# Altium project Flight_Controller.PrjPcb
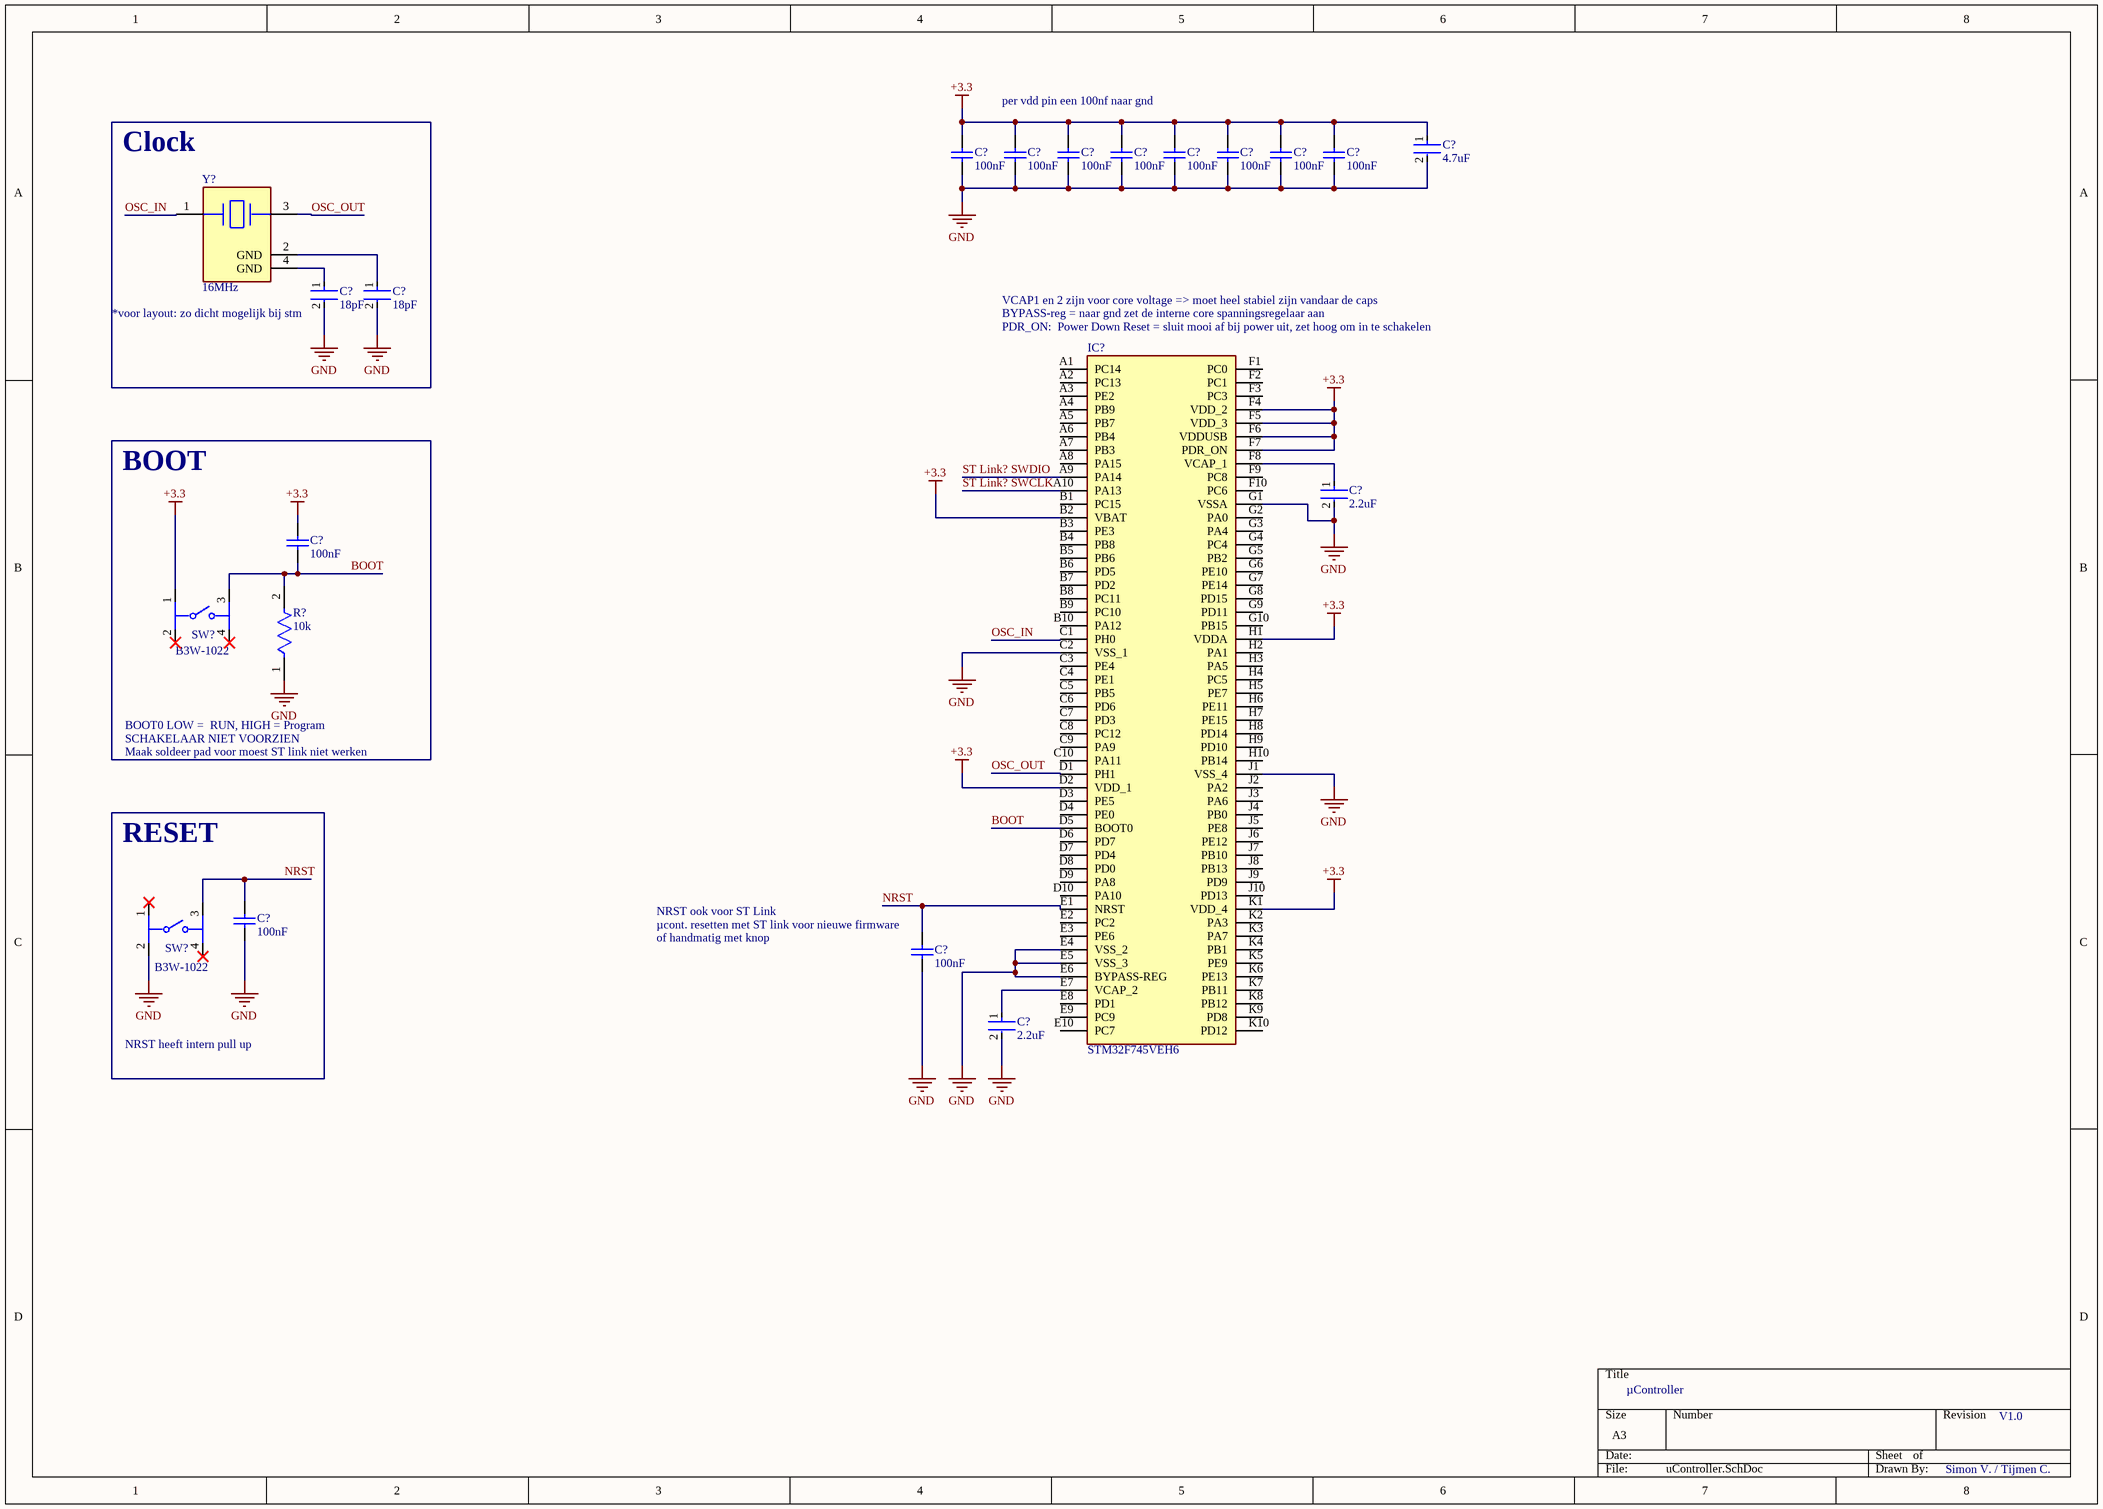
[diagram p0: uController.SchDoc]
5 sheets, 48 parts. Net scope: flat (ports and power ports of the same name join across sheets).
Sheets:
  uController.SchDoc
  Sensors.SchDoc
  Power.SchDoc
  Root.SchDoc
  High Freq.SchDoc

## Sheet uController.SchDoc
size A3; SheetNumber: 1; SheetTotal: 5

### Parts
(Parts that share a designator on the sheet are numbered #1, #2 ... from top to bottom, then left to right.)
C?#1  4.7uF  [FP-CC0603-DC-MFG]
C?#2  100nF  [CAPC1608X92X38ML15T08]
C?#3  100nF  [CAPC1608X92X38ML15T08]
C?#4  100nF  [CAPC1608X92X38ML15T08]
C?#5  100nF  [CAPC1608X92X38ML15T08]
C?#6  100nF  [CAPC1608X92X38ML15T08]
C?#7  100nF  [CAPC1608X92X38ML15T08]
C?#8  100nF  [CAPC1608X92X38ML15T08]
C?#9  100nF  [CAPC1608X92X38ML15T08]
C?#10  18pF  [FP-C0603C-CF-MFG]
C?#11  18pF  [FP-C0603C-CF-MFG]
C?#12  2.2uF  [FP-CC0603-DA-MFG]
C?#13  100nF  [CAPC1608X92X38ML15T08]
C?#14  100nF  [CAPC1608X92X38ML15T08]
C?#15  100nF  [CAPC1608X92X38ML15T08]
C?#16  2.2uF  [FP-CC0603-DA-MFG]
IC?#1  STM32F745VEH6  [BGA100C80P10X10_800X800X110]
R?#1  10k  [FP-MCT0603-MFG]
SW?#1  B3W-1022  [FP-B3W-1022-MFG]
SW?#2  B3W-1022  [FP-B3W-1022-MFG]
Y?  16MHz  [FP-ABM8-MFG]

### Nets
+3.3: C?#1.1 C?#2.2 C?#3.2 C?#4.2 C?#5.2 C?#6.2 C?#7.2 C?#8.2 C?#9.2 C?#13.2 IC?#1.B2(VBAT) IC?#1.D2(VDD_1) IC?#1.F4(VDD_2) IC?#1.F5(VDD_3) IC?#1.F6(VDDUSB) IC?#1.F7(PDR_ON) IC?#1.H1(VDDA) IC?#1.K1(VDD_4) SW?#1.1
GND: C?#1.2 C?#2.1 C?#3.1 C?#4.1 C?#5.1 C?#6.1 C?#7.1 C?#8.1 C?#9.1 C?#10.2 C?#11.2 C?#12.2 C?#14.1 C?#15.1 C?#16.2 IC?#1.C2(VSS_1) IC?#1.E4(VSS_2) IC?#1.E5(VSS_3) IC?#1.E6(BYPASS-REG) IC?#1.G1(VSSA) IC?#1.J1(VSS_4) R?#1.1 SW?#2.2  [project net BAT-]
BOOT: C?#13.1 IC?#1.D5(BOOT0) R?#1.2 SW?#1.3
NRST: C?#14.2 C?#15.2 IC?#1.E1(NRST) SW?#2.3
OSC_IN: IC?#1.C1(PH0) Y?.1
OSC_OUT: IC?#1.D1(PH1) Y?.3
ST Link? SWCLK: IC?#1.A10(PA13)
ST Link? SWDIO: IC?#1.A9(PA14)
NetC?#10_1: C?#10.1 Y?.4(GND)
NetC?#11_1: C?#11.1 Y?.2(GND)
NetC?#12_1: C?#12.1 IC?#1.F8(VCAP_1)
NetC?#16_1: C?#16.1 IC?#1.E7(VCAP_2)

Not connected (* = marked no-connect by the designer): IC?#1 A1(PC14) A2(PC13) A3(PE2) A4(PB9) A5(PB7) A6(PB4) A7(PB3) A8(PA15) B1(PC15) B3(PE3) B4(PB8) B5(PB6) B6(PD5) B7(PD2) B8(PC11) B9(PC10) B10(PA12) C3(PE4) C4(PE1) C5(PB5) C6(PD6) C7(PD3) C8(PC12) C9(PA9) C10(PA11) D3(PE5) D4(PE0) D6(PD7) D7(PD4) D8(PD0) D9(PA8) D10(PA10) E2(PC2) E3(PE6) E8(PD1) E9(PC9) E10(PC7) F1(PC0) F2(PC1) F3(PC3) F9(PC8) F10(PC6) G2(PA0) G3(PA4) G4(PC4) G5(PB2) G6(PE10) G7(PE14) G8(PD15) G9(PD11) G10(PB15) H2(PA1) H3(PA5) H4(PC5) H5(PE7) H6(PE11) H7(PE15) H8(PD14) H9(PD10) H10(PB14) J2(PA2) J3(PA6) J4(PB0) J5(PE8) J6(PE12) J7(PB10) J8(PB13) J9(PD9) J10(PD13) K2(PA3) K3(PA7) K4(PB1) K5(PE9) K6(PE13) K7(PB11) K8(PB12) K9(PD8) K10(PD12); SW?#1 2* 4*; SW?#2 1* 4*

### Notes on the sheet
- (near C?#3) per vdd pin een 100nf naar gnd
- Clock
- (near C?#10) *voor layout: zo dicht mogelijk bij stm
- VCAP1 en 2 zijn voor core voltage => moet heel stabiel zijn vandaar de caps
- (near IC?#1) BYPASS-reg = naar gnd zet de interne core spanningsregelaar aan
- (near IC?#1) PDR_ON:  Power Down Reset = sluit mooi af bij power uit, zet hoog om in te schakelen
- BOOT
- BOOT0 LOW =  RUN, HIGH = Program
- SCHAKELAAR NIET VOORZIEN
- Maak soldeer pad voor moest ST link niet werken
- RESET
- NRST ook voor ST Link
- (near C?#15) µcont. resetten met ST link voor nieuwe firmware
- of handmatig met knop
- NRST heeft intern pull up
- µController
- V1.0
- Simon V. / Tijmen C.

### Library data of the parts
C?#1 = CMP-03422-001038-2: CAP CER 4.7UF 6.3V X7R 0603; Tolerance: 20%; RoHS Compliant: Yes; Packaging: Cut Tape; Mount: Surface Mount; Case Code (Imperial): 0603; Voltage Rating: 6.3V; Min Operating Temperature: -55°C; Case/Package: 0603; Case Code (Metric): 1608; Max Operating Temperature: 125°C; Capacitance: 4.7uF
C?#2-C?#9 C?#13-C?#15 = CMP-2006-01140-1: Part Number: VJ0603Y104MXXAC; Manufacturer: Vitramon
C?#10 C?#11 = CMP-03020-018448-1: C0603 18 pF C0G 30ppm/°C 1.00% 50 V; Manufacturer: KEMET; Manufacturer Part Number: C0603C180F5GACAUTO; Voltage Rating: 50 V; Automotive Grade: Grade 1; Tolerance: 0.01; Material: Ceramic; Height: 0.87mm; Lead Free: Yes; Category: Cap; Capacitance: 18 pF; Temperature Characteristic: C0G; Device Class L3: Ceramic Capacitors; Package: C0603C-CF; ComponentLink2Description: Datasheet; Automotive: Yes; Temperature Range Low: -55°C; Device Class L1: Passive Components; ComponentLink2URL: https://api.kemet.com/component-edge/download/datasheet/C0603C100J5GACAUTO.pdf; Octopart: https://octopart.com/c0603c180f5gacauto-kemet-91893831; Value: 18 pF; Temperature: -55°C to +125°C; Temperature Range High: +125°C; Device Class L2: Capacitors; RoHS: TRUE; Temperature Coefficient: 30ppm/°C
C?#12 C?#16 = CMP-03422-000187-1: CC0603 2.2 uF X5R 10.00% 16 V; Manufacturer: YAGEO; Manufacturer Part Number: CC0603KPX5R7BB225; Voltage Rating: 16 V; Material: Ceramic; Tolerance: 0.1; Temperature Coefficient: 15%; ComponentLink2Description: Datasheet; Device Class L3: Ceramic Capacitors; Temperature Characteristic: X5R; Package: CC0603-DA; Automotive: No; Device Class L1: Passive Components; ComponentLink2URL: http://www.yageo.com/documents/recent/UPY-GPHC_X7R_6.3V-to-50V_18.pdf; Value: 2.2 uF; RoHS: TRUE; Height: 0.9mm; Temperature Range High: +125°C; Footprint Url: http://www.yageo.com/exep/pages/download/literatures/UPY-C_GEN_24.pdf; Lead Free: Yes; Temperature Range Low: -55°C; Capacitance: 2.2 uF; Octopart: https://octopart.com/cc0603kpx5r7bb225-yageo-91091799; Device Class L2: Capacitors; Voltage: 16 V; Temperature: -55°C to +125°C; Category: Cap
IC?#1 = STM32F745VEH6: Integrated Circuit; Manufacturer_Name: STMicroelectronics; Datasheet Link: https://www.st.com/resource/en/datasheet/stm32f745ie.pdf; Height: 1.1mm; Manufacturer_Part_Number: STM32F745VEH6; Mouser Part Number: 511-STM32F745VEH6; Mouser Price/Stock: https://www.mouser.co.uk/ProductDetail/STMicroelectronics/STM32F745VEH6?qs=dTJS0cRn7ogJy7Gdq90%252Bbw%3D%3D; Arrow Part Number: STM32F745VEH6; Arrow Price/Stock: https://www.arrow.com/en/products/stm32f745veh6/stmicroelectronics?region=nac
R?#1 = CMP-02407-002367-1: RES SMD 100 OHM 1% 1/8W 0603; Max Power Dissipation: 100mW; Temperature Coefficient: 15ppm/°C; Resistance: 10kR; Tolerance: 0.1%; Length: 0.061inch; Min Operating Temperature: -55°C; Case/Package: 0603; Max Operating Temperature: 125°C; Number of Terminations: 2; Packaging: Tape and Reel; Width: 0.033inch; Composition: Thin Film; Height: 0.022inch; Package Quantity: 1000
SW?#1 SW?#2 = CMP-08834-000055-1: SWITCH TACTILE SPST-NO 0.05A 24V; Operating Force: 230gf; Switch Function: Off-Mom; Switch Travel: 0.25mm; Throw Configuration: SPST; Actuator Type: Standard; Illumination Type: Non-Illuminated; Ratings: IP67; Mechanical Life: 1000000Cycles; Packaging: Bulk; Termination: PC Pin; Max Operating Temperature: 70°C; RoHS Compliant: Yes; Mount: Through Hole; Min Operating Temperature: -25°C
Y? = CMP-27762-003067-1: Crystal 16MHz ±20ppm 18pF SMD-4 3.2mm x 2.5mm                      ABM8-16.000MHZ-B2-T3; Frequency Stability: 50ppm; ESR (Equivalent Series Resistance): 70R; Packaging: Tape and Reel; Load Capacitance: 18pF; Min Operating Temperature: -20°C; Case/Package: SMD/SMT; Length: 0.126inch; RoHS Compliant: Yes; Max Operating Temperature: 70°C; Width: 0.098inch; Series: ABM8; Frequency: 16MHz; Height: 0.031inch; Mount: Surface Mount; Frequency Tolerance: 20ppm

## Sheet Sensors.SchDoc
size A4; SheetNumber: 3; SheetTotal: 5
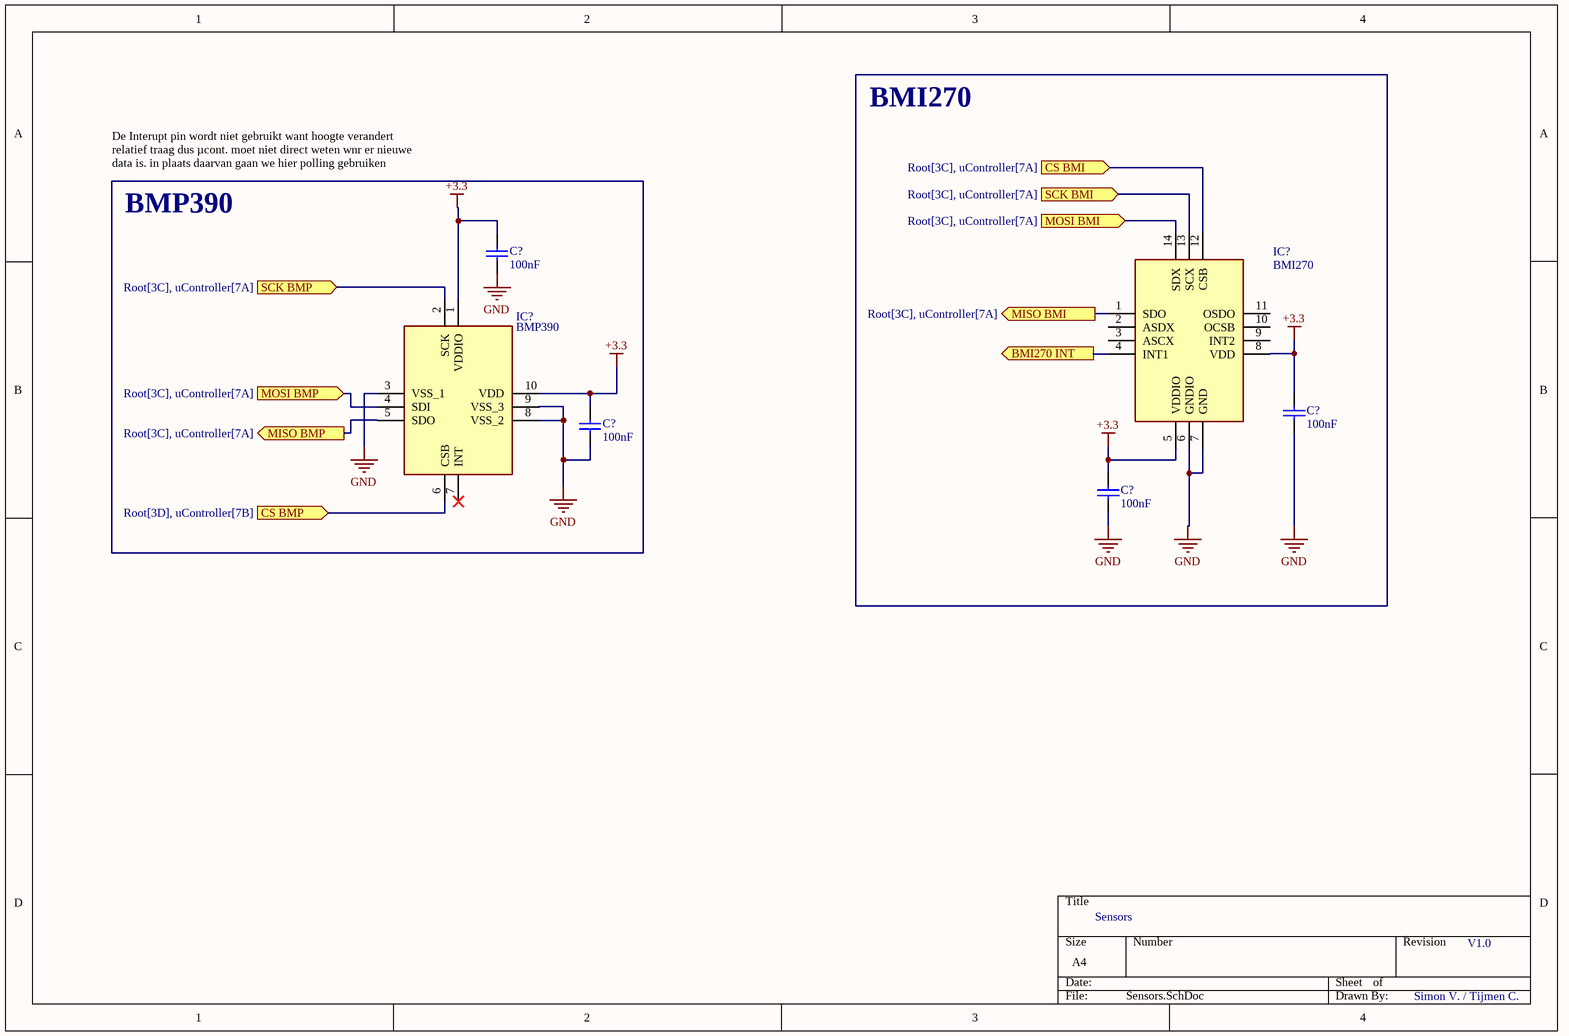
[diagram p1: Sensors.SchDoc]

### Parts
(Parts that share a designator on the sheet are numbered #1, #2 ... from top to bottom, then left to right.)
C?#17  100nF  [CAPC1608X92X38ML15T08]
C?#18  100nF  [CAPC1608X92X38ML15T08]
C?#19  100nF  [CAPC1608X92X38ML15T08]
C?#20  100nF  [CAPC1608X92X38ML15T08]
IC?#2  BMI270  [BMI270]
IC?#3  BMP390  [BMP390]

### Ports
BMI270 INT (out), CS BMI (in, see Root[3C], uController[7A]), CS BMP (in, see Root[3D], uController[7B]), MISO BMI (out, see Root[3C], uController[7A]), MISO BMP (out, see Root[3C], uController[7A]), MOSI BMI (in, see Root[3C], uController[7A]), MOSI BMP (in, see Root[3C], uController[7A]), SCK BMI (in, see Root[3C], uController[7A]), SCK BMP (in, see Root[3C], uController[7A])

### Nets
+3.3: C?#17.2 C?#18.2 C?#19.2 C?#20.2 IC?#2.5(VDDIO) IC?#2.8(VDD) IC?#3.1(VDDIO) IC?#3.10(VDD)
GND: C?#17.1 C?#18.1 C?#19.1 C?#20.1 IC?#2.6(GNDIO) IC?#2.7(GND) IC?#3.3(VSS_1) IC?#3.8(VSS_2) IC?#3.9(VSS_3)  [project net BAT-]
NetIC?#2_1: IC?#2.1(SDO) ; port MISO BMI
NetIC?#2_4: IC?#2.4(INT1) ; port BMI270 INT
NetIC?#2_12: IC?#2.12(CSB) ; port CS BMI
NetIC?#2_13: IC?#2.13(SCX) ; port SCK BMI
NetIC?#2_14: IC?#2.14(SDX) ; port MOSI BMI
NetIC?#3_2: IC?#3.2(SCK) ; port SCK BMP
NetIC?#3_4: IC?#3.4(SDI) ; port MOSI BMP
NetIC?#3_5: IC?#3.5(SDO) ; port MISO BMP
NetIC?#3_6: IC?#3.6(CSB) ; port CS BMP

Not connected (* = marked no-connect by the designer): IC?#2 2(ASDX) 3(ASCX) 9(INT2) 10(OCSB) 11(OSDO); IC?#3 7(INT)*

### Notes on the sheet
- BMI270
- De Interupt pin wordt niet gebruikt want hoogte verandert relatief traag dus µcont. moet niet direct weten wnr er nieuwe data is. in plaats daarvan gaan we hier polling gebruiken
- BMP390
- Sensors
- V1.0
- Simon V. / Tijmen C.

### Library data of the parts
C?#17-C?#20 = CMP-2006-01140-1: as C?#2 on sheet uController
IC?#2 = BMI270: Integrated Circuit; Manufacturer_Name: BOSCH; Datasheet Link: https://www.bosch-sensortec.com/media/boschsensortec/downloads/datasheets/bst-bmi270-ds000.pdf; Height: 0.87mm; Manufacturer_Part_Number: BMI270; Mouser Part Number: 262-BMI270; Mouser Price/Stock: https://www.mouser.co.uk/ProductDetail/Bosch-Sensortec/BMI270?qs=u16ybLDytRYIj%252BjQEee88A%3D%3D; Arrow Part Number: BMI270; Arrow Price/Stock: https://www.arrow.com/en/products/bmi270/bosch-sensortec?utm_currency=USD&region=europe
IC?#3 = BMP390: Integrated Circuit; Manufacturer_Name: BOSCH; Datasheet Link: https://www.bosch-sensortec.com/media/boschsensortec/downloads/datasheets/bst-bmp390-ds002.pdf; Height: 0.8mm; Manufacturer_Part_Number: BMP390; Mouser Part Number: 262-BMP390; Mouser Price/Stock: https://www.mouser.co.uk/ProductDetail/Bosch-Sensortec/BMP390?qs=QNEnbhJQKvYQVfvRMgo2YA%3D%3D; Arrow Part Number: BMP390; Arrow Price/Stock: https://www.arrow.com/en/products/bmp390/bosch-sensortec?utm_currency=USD&region=nac

## Sheet Power.SchDoc
size A4; SheetNumber: 3; SheetTotal: 5
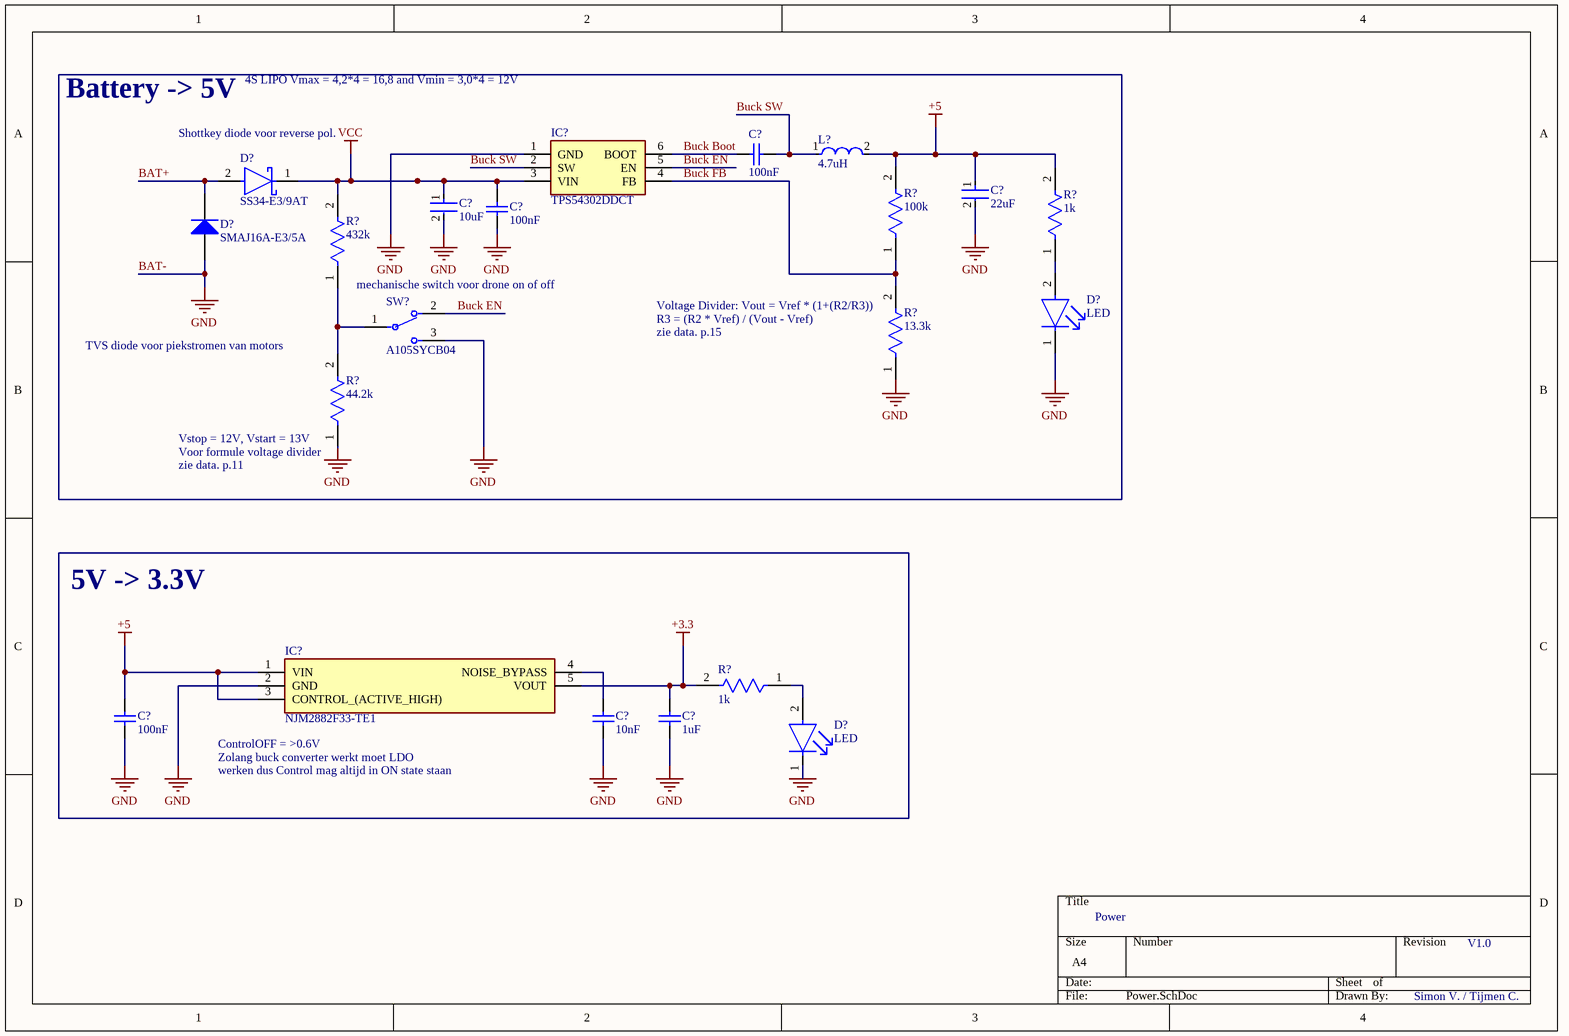
[diagram p2: Power.SchDoc]

### Parts
(Parts that share a designator on the sheet are numbered #1, #2 ... from top to bottom, then left to right.)
C?#21  100nF  [CAPC1608X92X38ML15T08]
C?#22  22uF  [FP-GRM188-0_2-IPC_A]
C?#23  10uF  [FP-ZRB18AR61E106ME01L-MFG]
C?#24  100nF  [CAPC1608X92X38ML15T08]
C?#25  100nF  [CAPC1608X92X38ML15T08]
C?#26  10nF  [CAPC1608X92X38LL15T08]
C?#27  1uF  [CAPC1608X90X35NL15T15]
D?#1  SS34-E3/9AT  [FP-SMC-MFG]
D?#2  SMAJ16A-E3/5A  [VISH-DO-214AC-2_M]
D?#3  LED  [FP-APHD1608LZGCK-MFG]
D?#4  LED  [FP-APHD1608LZGCK-MFG]
IC?#4  TPS54302DDCT  [SOT95P280X110-6N]
IC?#5  NJM2882F33-TE1  [SOT95P280X130-5N]
L?  4.7uH  [FP-IHLP-2020BZ-FP_1_905x2-MFG]
R?#2  100k  [FP-SR0603-MFG]
R?#3  1k  [FP-AC0603-IPC_B]
R?#4  432k  [FP-AC0603-MFG]
R?#5  13.3k  [FP-AF0603-IPC_A]
R?#6  44.2k  [FP-CRCW0603-HPe3-IPC_A]
R?#7  1k  [FP-AC0603-IPC_B]
SW?#3  A105SYCB04  [FP-A105SYCB04-MFG]

### Nets
+3.3: C?#27.2 IC?#5.5(VOUT) R?#7.2
+5: C?#22.1 C?#25.2 IC?#5.1(VIN) IC?#5.3(CONTROL_(ACTIVE_HIGH)) L?.2 R?#2.2 R?#3.2
BAT-: C?#22.2 C?#23.2 C?#24.1 C?#25.1 C?#26.1 C?#27.1 D?#2.2(A) D?#3.1(C) D?#4.1(C) IC?#4.1(GND) IC?#5.2(GND) R?#5.1 R?#6.1 SW?#3.3  [also labelled GND]
VCC: C?#23.1 C?#24.2 D?#1.1(C) IC?#4.3(VIN) R?#4.2
BAT+: D?#1.2(A) D?#2.1(K)
Buck Boot: C?#21.2 IC?#4.6(BOOT)
Buck EN: IC?#4.5(EN) SW?#3.2
Buck FB: IC?#4.4(FB) R?#2.1 R?#5.2
Buck SW: C?#21.1 IC?#4.2(SW) L?.1
NetC?#26_2: C?#26.2 IC?#5.4(NOISE_BYPASS)
NetD?#3_2: D?#3.2(A) R?#3.1
NetD?#4_2: D?#4.2(A) R?#7.1
NetR?#4_1: R?#4.1 R?#6.2 SW?#3.1

### Notes on the sheet
- Battery -> 5V
- 4S LIPO Vmax = 4,2*4 = 16,8 and Vmin = 3,0*4 = 12V
- (near D?#1) Shottkey diode voor reverse pol.
- mechanische switch voor drone on of off
- (near R?#5) Voltage Divider: Vout = Vref * (1+(R2/R3))
- (near R?#6) TVS diode voor piekstromen van motors
- zie data. p.15
- (near R?#5) R3 = (R2 * Vref) / (Vout - Vref)
- (near R?#6) Vstop = 12V, Vstart = 13V
- (near R?#6) Voor formule voltage divider
- zie data. p.11
- 5V -> 3.3V
- (near IC?#5) ControlOFF = >0.6V
- (near IC?#5) Zolang buck converter werkt moet LDO
- werken dus Control mag altijd in ON state staan
- Power
- V1.0
- Simon V. / Tijmen C.

### Library data of the parts
C?#21 C?#24 C?#25 = CMP-2006-01140-1: as C?#2 on sheet uController
C?#22 = CMP-06035-063651-1: Multilayer Ceramic Capacitor 22uF 20% 16V X5R 0603 Paper T/R
C?#23 = CMP-06035-062385-2: CAP CER 10UF 25V X5R 0603; Tolerance: 20%; Min Operating Temperature: -55°C; Voltage: 25V; Case Code (Imperial): 0603; Case Code (Metric): 1608; Voltage Rating (DC): 25V; Max Operating Temperature: 85°C; Depth: 0.8mm; Thickness: 0.047inch; RoHS Compliant: Yes; Dielectric: X5R; Mount: Surface Mount; Voltage Rating: 25V; Length: 0.063inch; Height: 1mm; Packaging: Cut Tape; Capacitance: 10uF; REACH SVHC: No SVHC; Width: 0.031inch; Case/Package: 0603
C?#26 = CMP-2006-01201-1: Manufacturer: Vitramon; Part Number: VJ0603Y103JXXAC
C?#27 = CMP-2006-04534-1: Part Number: 0603YD105MAT2A; Manufacturer: AVX Interconnect / Elco
D?#1 = CMP-02539-000066-1: DIODE SCHOTTKY 40V 3A DO214AB; Peak Non-Repetitive Surge Current: 100A; Forward Voltage: 500mV; Element Configuration: Single; Max Reverse Current: 500uA; Case/Package: SMC; Radiation Hardening: No; Series: -; Max Surge Current: 100A; RoHS Compliant: Yes; Min Operating Temperature: -55°C; Average Rectified Current: 3A; Max Reverse Leakage Current: 500uA; Package Quantity: 3500; Max Reverse Voltage (DC): 40V; Forward Current: 3A; Packaging: Tape and Reel; Max Operating Temperature: 125°C; Max Repetitive Reverse Voltage (Vrrm): 40V; Number of Pins: 2; Mount: Surface Mount
D?#2 = CMP-0548-00305-2: Transient Voltage Suppressor, 6.40 to 231 V, 16 V Stand-off Voltage, Uni-Directional, -55 to 155 degC, 2-pin DO-214AC, Pb-Free, Tape and Reel; Manufacturer: Vishay Semiconductor; VWM (V): 16; ID (uA): 1; PPPM (W): 400, 300; VBR Uni-Directional (V): 6.4 to 231; IFSM: 40 A; PackageReference: DO-214AC-2; ComponentLink2Description: Datasheet; Operating Junction and Storage Temperature Range: -55 to 150 degC; PackageDescription: 2-Pin DO-214AC (SMA), Body 4.245 x 2.665 mm; Packing: Tape and Reel; DatasheetVersion: 12/8/2013; ComponentLink1URL: http://www.vishay.com/; Mounting Technology: Surface Mount; RoHS: TRUE; ComponentLink1Description: Manufacturer URL; ComponentLink2URL: http://www.vishay.com/docs/88390/smaj50a.pdf; ComponentLink3Description: Package Specification; PartNumber: SMAJ16A-E3/5A; ComponentLink3URL: http://www.vishay.com/docs/88390/smaj50a.pdf
D?#3 D?#4 = CMP-44529-000045-1: LED GREEN CLEAR 1608 SMD, type: APHD1608LZGCK; Test Current: 2mA; Dominant Wavelength: 525nm; Lens Color: Colorless; Luminous Intensity: 180mcd; Viewing Angle: 100°; Forward Voltage: 2.65V; Lens Size: 0.7mm; Lens Style: Round; Mount: Surface Mount; Packaging: Tape and Reel; Lens Transparency: Clear; Height: 0.75mm; Case/Package: 0603; Length: 1.6mm; Case Code (Metric): 1608; Width: 0.8mm; Color: Green; Case Code (Imperial): 0603
IC?#4 = TPS54302DDCT: Integrated Circuit; Manufacturer_Name: Texas Instruments; Datasheet Link: https://componentsearchengine.com/Datasheets/2/TPS54302DDCT.pdf; Height: 1.1mm; Manufacturer_Part_Number: TPS54302DDCT; Mouser Part Number: 595-TPS54302DDCT; Mouser Price/Stock: https://www.mouser.co.uk/ProductDetail/Texas-Instruments/TPS54302DDCT?qs=zEmsApcVOkXGTx6CMk2KtQ%3D%3D; Arrow Part Number: TPS54302DDCT; Arrow Price/Stock: https://www.arrow.com/en/products/tps54302ddct/texas-instruments?utm_currency=USD&region=nac
IC?#5 = NJM2882F33-TE1: Integrated Circuit; Manufacturer_Name: New Japan Radio; Datasheet Link: https://datasheet.datasheetarchive.com/originals/distributors/Datasheets_SAMA/4727f49f1a6595e3af9a467a77f12495.pdf; Height: 1.3mm; Manufacturer_Part_Number: NJM2882F33-TE1; Mouser Part Number: 513-NJM2882F33-TE1; Mouser Price/Stock: https://www.mouser.co.uk/ProductDetail/NJR/NJM2882F33-TE1?qs=A8FRqtAK7u9DuEIVjsUa8Q%3D%3D
L? = CMP-02424-000137-1: Fixed Inductors Commercial High Saturation Series 4.7uH 2.8A 116.6mΩ 20%; Self Resonant Frequency: 28MHz; Test Frequency: 100kHz; Shielding: Shielded; Core Material: Metal; DC Resistance (DCR): 116.6mR; Max DC Current: 3A; Saturation Current: 5A; Radiation Hardening: No; Inductance: 4.7uH; Width: 0.204inch; Packaging: Tape and Reel; Height - Seated (Max): 0.079inch; Height: 2mm; Tolerance: 20%; RMS Current (Irms): 2.8A; Mount: Surface Mount; Military Standard: Not; Termination: SMD/SMT; Min Operating Temperature: -55°C; Max Operating Temperature: 125°C; Case/Package: 2020; Depth: 5.43mm; Package Quantity: 2000; Current Rating: 2.8A; Length: 5.49mm; Inductance Tolerance: 20%
R?#2 = CMP-03412-000894-1: RES SMD 0603 1/4W 1% 100K OHM; Manufacturer Part Number: SR0603FR-7T100KL; Manufacturer: Yageo; Description: SR0603 100KΩ 0.25W 1.00%; Tolerance: 0.01; Voltage Rating: 75V; Value: 100KΩ; Power Rating: 0.25W; Automotive Grade: Grade 0; Ipc Land Pattern Name: RESC16080X45; Digikey Description: RES SMD 0603 1/4W 1% 100K OHM; Device Class L3: Chip SMD Resistors; Octopart: https://octopart.com/sr0603fr-7t100kl-yageo-91478071; Lead Free: Yes; RoHS: TRUE; Series: SR; Device Class L1: Passive Components; ComponentLink2URL: http://www.yageo.com/documents/recent/PYu-SR_D_F%20tol_RoHS_L_3.pdf; ComponentLink2Description: Datasheet; Automotive: Yes; Category: Res; Temperature Range High: +155°C; Height: 0.55mm; Composition: Thick Film; Resistance: 100KΩ; Temperature Range Low: -55°C; Footprint Url: http://www.yageo.com/exep/pages/download/literatures/PYu-R_Mount_10.pdf; Device Class L2: Resistors; Temperature: -55°C to +155°C; Package: SR0603
R?#3 R?#7 = CMP-03412-047577-1: RES 1kΩ 1.00% 0.2W 0603
R?#4 = CMP-03412-010825-2: RES 432KΩ 1.00% 0.1W 0603; Resistance: 432kR; Temperature Coefficient: 100ppm/°C; Tolerance: 1%; Max Power Dissipation: 100mW; Voltage Rating: 50V; Case Code (Imperial): 0603; Max Operating Temperature: 155°C; Packaging: Tape and Reel; Case/Package: 0603; Min Operating Temperature: -55°C; Height: 0.022inch; Width: 0.8mm; Number of Terminations: 2; Resistor Type: Thick Film; Series: AC; Features: Moisture Resistant; Case Code (Metric): 1608; Length: 0.063inch; Power Rating: 100mW; RoHS Compliant: Yes; Termination: SMD/SMT
R?#5 = CMP-03412-046877-1: Anti-Sulfurated Chip Resistors Automotive Grade 13.3kΩ 1% 100ppm/°C 0603; Resistance: 13.3kR; Max Power Dissipation: 100mW; Resistor Type: Thick Film; Min Operating Temperature: -55°C; Number of Terminations: 2; Temperature Coefficient: 100ppm/°C; Height: 0.022inch; Case/Package: 0603; Max Operating Temperature: 155°C; Series: AF; Tolerance: 1%; Length: 0.063inch; RoHS Compliant: Yes; Packaging: Tape and Reel; Width: 0.031inch; Features: Moisture Resistant
R?#6 = CMP-02407-008692-1: RES Thick Film, 44.2kΩ, 1%, 0.33W, 100ppm/°C, 0603; Resistance: 44.2kR; Max Power Dissipation: 250mW; Length: 0.063inch; Contact Plating: Tin; Height: 0.022inch; Composition: Thick Film; Temperature Coefficient: 100ppm/°C; Termination: Wraparound; Mount: Surface Mount; Package Quantity: 5000; Lead Free: Lead Free; Case/Package: 0603; Width: 0.033inch; Packaging: Tape and Reel; Power Rating: 250mW; Max Operating Temperature: 155°C; Number of Terminations: 2; Features: Automotive AEC-Q200; Tolerance: 1%; Min Operating Temperature: -55°C
SW?#3 = CMP-03408-000016-1: SWITCH TOGGLE SPDT 0.4VA 20V; Power Rating: 400mW; Insulation Resistance: 30MR; Actuator Length: 10.41mm; Illumination Type: Illuminated; Contact Resistance: 10mR; Contact Current Rating: 400mA; Actuator Material: Phenolic; Contact Material: Copper; Termination: Solder; Throw Configuration: SPDT; Contact Plating: Gold; REACH SVHC: No SVHC; Series: Gemini A; Mount: Bushing; Package Quantity: 100; Voltage Rating (AC): 20V; Min Operating Temperature: -30°C; Max Voltage Rating (DC): 20V; Max Operating Temperature: 85°C; Flammability Rating: UL94 V-0; RoHS Compliant: Yes

## Sheet Root.SchDoc
size A4; SheetNumber: 4; SheetTotal: 5
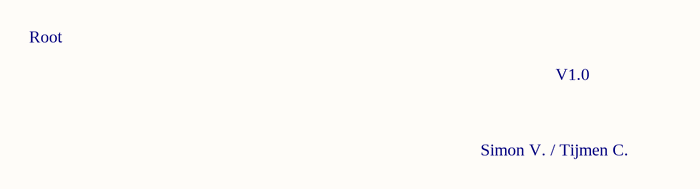
[diagram p3: Root.SchDoc]

### Notes on the sheet
- Root
- V1.0
- Simon V. / Tijmen C.

## Sheet High Freq.SchDoc
size A4; SheetNumber: 5; SheetTotal: 5
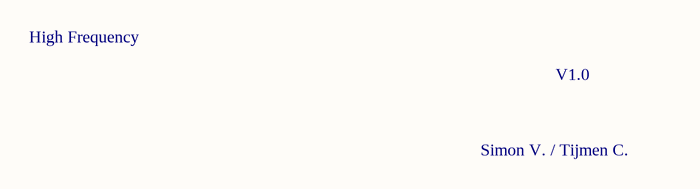
[diagram p4: High Freq.SchDoc]

### Notes on the sheet
- High Frequency
- V1.0
- Simon V. / Tijmen C.

## Nets that join several sheets
+3.3: uController (19 pins), Sensors (8 pins), Power (C?#27.2 IC?#5.5 R?#7.2)
BAT-: uController (23 pins), Sensors (9 pins), Power (14 pins)